# Altium schematic sheet nusense-monitors.schdoc: NUSense
size A4; Organization: Elby Designs; Address1: 9 Follan Close; Address2: Kariong; Address3: NSW 2250; Address4: Australia; Revision: 1; SheetNumber: 0; SheetTotal: 0; DrawnBy: Current & Voltage Monitors; Engineer: Laurie Biddulph; PageSetup: Record=PageOptions|CenterHorizontal=True|CenterVertical=True|PrintScale=1.38|XCorrection=1.00|YCorrection=1.00|PrintKind=1|BorderSize=5000000|LeftOffset=0|BottomOffset=0|Orientation=2|PaperLength=1000|PaperWidth=1000|Scale=100|PaperSource=7|PrintQuality=-4|MediaType=1|DitherType=10|PaperKind=A3|PrintScaleMode=1
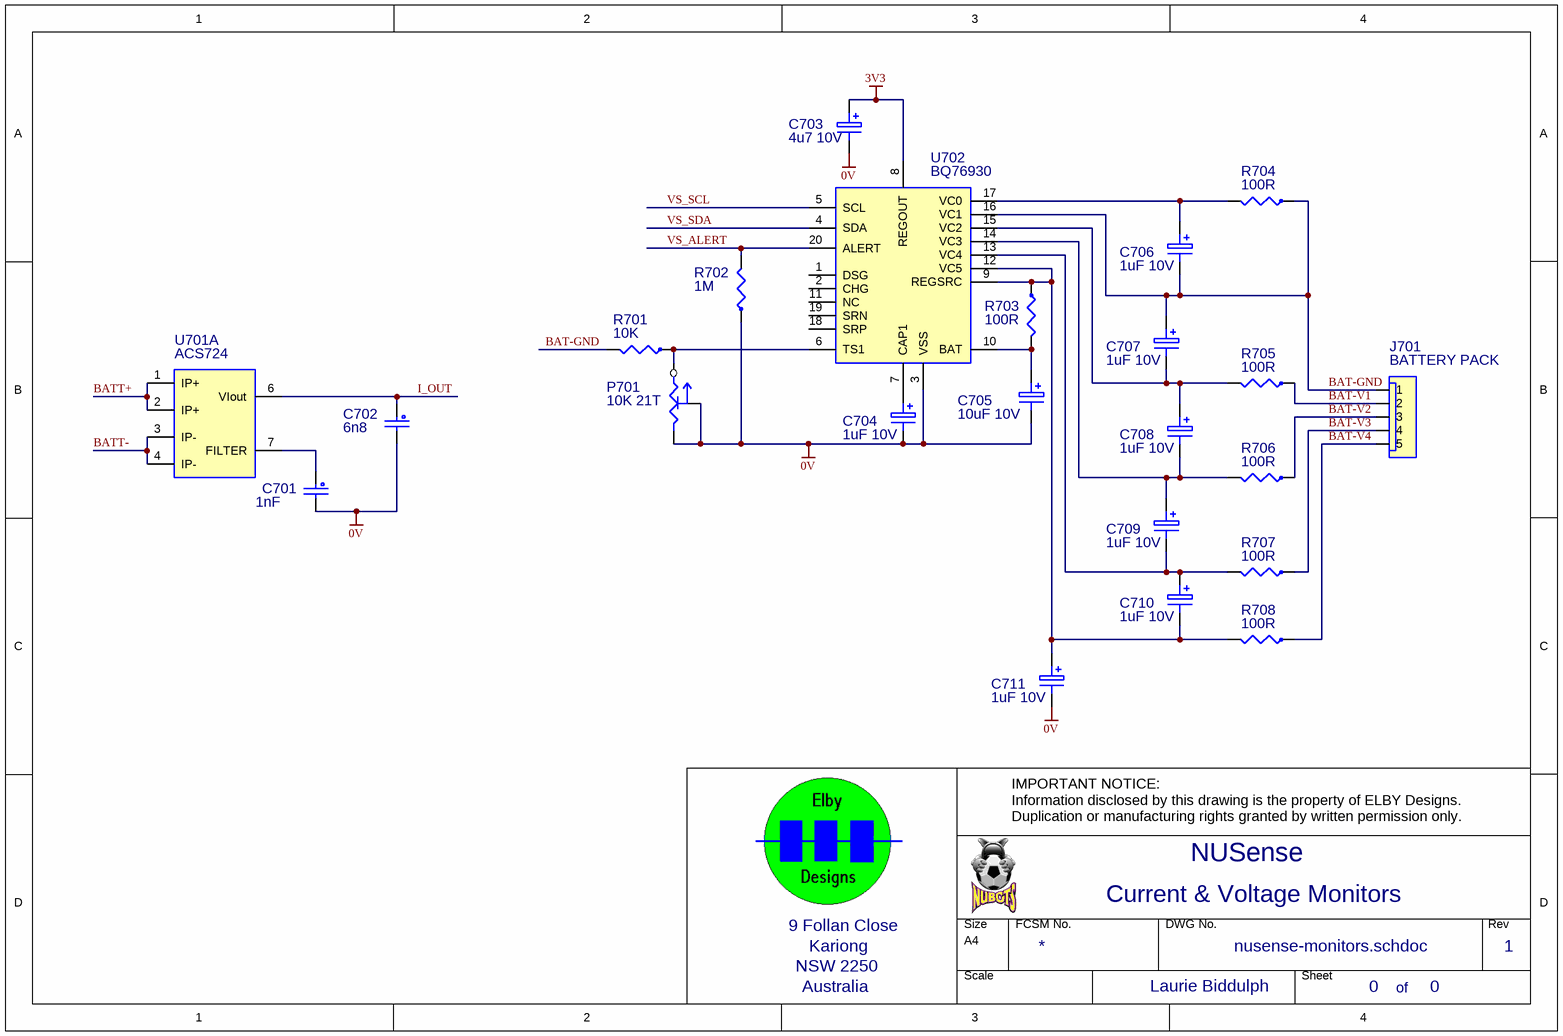
[diagram p0: nusense-monitors.schdoc]

## Parts
C701  1nF  [RAD-0.2(LB)]
C702  6n8  [RAD-0.2(LB)]
C703  4u7 10V  [RB-D5.0-P2.0]
C704  1uF 10V  [RB-D5.0-P2.0]
C705  10uF 10V  [RB-D6.3-P2.5]
C706  1uF 10V  [RB-D5.0-P2.0]
C707  1uF 10V  [RB-D5.0-P2.0]
C708  1uF 10V  [RB-D5.0-P2.0]
C709  1uF 10V  [RB-D5.0-P2.0]
C710  1uF 10V  [RB-D5.0-P2.0]
C711  1uF 10V  [RB-D5.0-P2.0]
J701  BATTERY PACK  [MTA-5V(LB)]
P701  10K 21T  [TRIMPOT(LB)]
R701  10K  [AXIAL-0.4(LB)]
R702  1M  [AXIAL-0.4(LB)]
R703  100R  [AXIAL-0.4(LB)]
R704  100R  [AXIAL-0.4(LB)]
R705  100R  [AXIAL-0.4(LB)]
R706  100R  [AXIAL-0.4(LB)]
R707  100R  [AXIAL-0.4(LB)]
R708  100R  [AXIAL-0.4(LB)]
U701  ACS724  (part A of 2)
U702  BQ76930

## Nets
0V: C701.2 C702.2 C703.2 C704.2 C705.2 C711.2 P701.1(A) P701.2(W) R702.1 U702.3(VSS)
3V3: C703.1 U702.8(REGOUT)
BAT-GND: C706.2 C707.1 J701.1 R701.2 R704.1 U702.16(VC1)
BAT-V1: J701.2 R705.1
BAT-V2: J701.3 R706.1
BAT-V3: J701.4 R707.1
BAT-V4: J701.5 R708.1
BATT+: U701.1(IP+) U701.2(IP+)
BATT-: U701.3(IP-) U701.4(IP-)
I_OUT: C702.1 U701.6(VIout)
VS_ALERT: R702.2 U702.20(ALERT)
VS_SCL: U702.5(SCL)
VS_SDA: U702.4(SDA)
NetC701_1: C701.1 U701.7(FILTER)
NetC704_1: C704.1 U702.7(CAP1)
NetC705_1: C705.1 R703.2 U702.10(BAT)
NetC706_1: C706.1 R704.2 U702.17(VC0)
NetC707_2: C707.2 C708.1 R705.2 U702.15(VC2)
NetC708_2: C708.2 C709.1 R706.2 U702.14(VC3)
NetC709_2: C709.2 C710.1 R707.2 U702.13(VC4)
NetC710_2: C710.2 C711.1 R703.1 R708.2 U702.9(REGSRC) U702.12(VC5)
NetP701_3: P701.3(C) R701.1 U702.6(TS1)

Not connected (* = marked no-connect by the designer): U702 1(DSG) 2(CHG) 11(NC) 18(SRP) 19(SRN)

## Notes on the sheet
- IMPORTANT NOTICE:
  Information disclosed by this drawing is the property of ELBY Designs.
  Duplication or manufacturing rights granted by written permission only.
- of

## Library data of the parts
C701 = CP-1NF(LB): 63V 10% Metallised Polyester; EMRP: CP-1N0F
C702 = CP-6N8F(LB): 63V 10% Metallised Polyester; EMRP: CP-6N8F
C703 = CE-4U7F50V(LB): 20% 50V Aluminium Electrolytic; EMRP: CE-4U7F
C704 C706-C711 = CE-1UF50V(LB): 20% 50V Aluminium Electrolytic; EMRP: CE-1UF
C705 = CE-10UF50V(LB): 20% 50V Aluminium Electrolytic; EMRP: CE-10UF
J701 = MTA-5V(LB): EMRP: JC-05P
P701 = RT-10K(LB): Multiturn Trimpot (Spectrol 64W); EMRP: RT-6-10K
R701 = RM-10K(LB): 0.5W 1% Metal Film Resistor; EMRP: RM-10K
R702 = RM-1M(LB): 0.5W 1% Metal Film Resistor; EMRP: RM-1M
R703-R708 = RM-100R(LB): 0.5W 1% Metal Film Resistor; EMRP: RM-100R
U701 = ACS724: Current Monitor
U702 = BQ76930: Battery Monitor